# Altium schematic sheet 26_AKS.SchDoc
size 254 x 190 mm; SheetNumber: 1; SheetTotal: 1
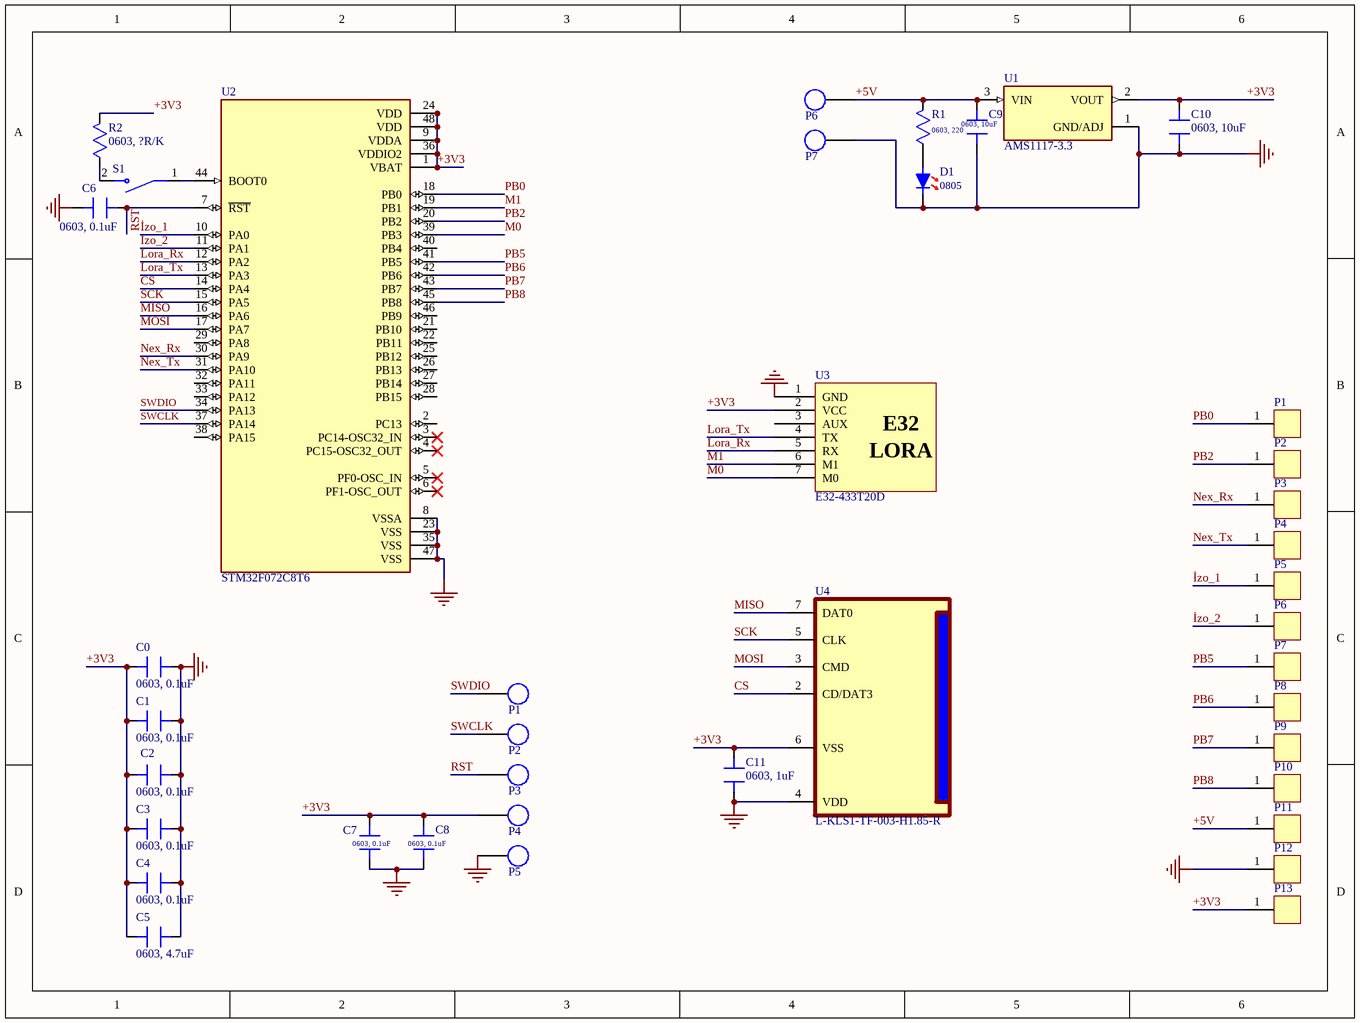
[diagram p0: 26_AKS.SchDoc]

## Parts
(Parts that share a designator on the sheet are numbered #1, #2 ... from top to bottom, then left to right.)
C0  0603, 0.1uF  [CAP 0603_1608]
C1  0603, 0.1uF  [CAP 0603_1608]
C2  0603, 0.1uF  [CAP 0603_1608]
C3  0603, 0.1uF  [CAP 0603_1608]
C4  0603, 0.1uF  [CAP 0603_1608]
C5  0603, 4.7uF  [CAP 0603_1608]
C6  0603, 0.1uF  [CAP 0603_1608]
C7  0603, 0.1uF  [CAP 0603_1608]
C8  0603, 0.1uF  [CAP 0603_1608]
C9  0603, 10uF  [CAP 0603_1608]
C10  0603, 10uF  [CAP 0603_1608]
C11  0603, 1uF  [CAP 0603_1608]
D1  0805  [LED 0805_2012 RED]
P1#1  Pad  [Pad]  (value not drawn)
P1#2  Pad  [PAD]  (value not drawn)
P2#1  Pad  [Pad]  (value not drawn)
P2#2  Pad  [PAD]  (value not drawn)
P3#1  Pad  [Pad]  (value not drawn)
P3#2  Pad  [PAD]  (value not drawn)
P4#1  Pad  [Pad]  (value not drawn)
P4#2  Pad  [PAD]  (value not drawn)
P5#1  Pad  [Pad]  (value not drawn)
P5#2  Pad  [PAD]  (value not drawn)
P6#1  Pad  [PAD]  (value not drawn)
P6#2  Pad  [Pad]  (value not drawn)
P7#1  Pad  [PAD]  (value not drawn)
P7#2  Pad  [Pad]  (value not drawn)
P8  Pad  [Pad]  (value not drawn)
P9  Pad  [Pad]  (value not drawn)
P10  Pad  [Pad]  (value not drawn)
P11  Pad  [Pad]  (value not drawn)
P12  Pad  [Pad]  (value not drawn)
P13  Pad  [Pad]  (value not drawn)
R1  0603, 220  [RES 0603_1608]
R2  0603, ?R/K  [RES 0603_1608]
S1  KAE01SGGT  [SW_KAE01SGGT]  (value not drawn)
U1  AMS1117-3.3  [SOT229P700X180-4N]
U2  STM32F072C8T6  [QFP50P900X900X160-48N]
U3  E32-433T20D  [LORA-E32]
U4  L-KLS1-TF-003-H1.85-R  [L-KLS1-TF-003-H1.85-R]

## Nets
GND: C0.1 C1.1 C2.1 C3.1 C4.2 C5.2 C6.2 C7.2 C8.2 C9.1 C10.1 C11.2 D1.2 P5#2.1 P7#1.1 P12.1 U1.1(GND/ADJ) U2.8(VSSA) U2.23(VSS) U2.35(VSS) U2.47(VSS) U3.1(GND) U4.4(VDD)
+3V3: C0.2 C1.2 C2.2 C3.2 C4.1 C5.1 C7.1 C8.1 C10.2 C11.1 P4#2.1 P13.1 R2.2 U1.2(VOUT) U2.1(VBAT) U2.9(VDDA) U2.24(VDD) U2.36(VDDIO2) U2.48(VDD) U3.2(VCC) U4.6(VSS)
+5V: C9.2 P6#1.1 P11.1 R1.2 U1.3(VIN)
CS: U2.14(PA4) U4.2(CD/DAT3)
İzo_1: P5#1.1 U2.10(PA0)
İzo_2: P6#2.1 U2.11(PA1)
Lora_Rx: U2.12(PA2) U3.5(RX)
Lora_Tx: U2.13(PA3) U3.4(TX)
M0: U2.39(PB3) U3.7(M0)
M1: U2.19(PB1) U3.6(M1)
MISO: U2.16(PA6) U4.7(DAT0)
MOSI: U2.17(PA7) U4.3(CMD)
Nex_Rx: P3#1.1 U2.30(PA9)
Nex_Tx: P4#1.1 U2.31(PA10)
PB0: P1#1.1 U2.18(PB0)
PB2: P2#1.1 U2.20(PB2)
PB5: P7#2.1 U2.41(PB5)
PB6: P8.1 U2.42(PB6)
PB7: P9.1 U2.43(PB7)
PB8: P10.1 U2.45(PB8)
RST: C6.1 P3#2.1 U2.7(~{RST})
SCK: U2.15(PA5) U4.5(CLK)
SWCLK: P2#2.1 U2.37(PA14)
SWDIO: P1#2.1 U2.34(PA13)
NetD1_1: D1.1 R1.1
NetR2_1: R2.1 S1.2
NetS1_1: S1.1 U2.44(BOOT0)

Not connected (* = marked no-connect by the designer): U2 2(PC13) 3(PC14-OSC32_IN)* 4(PC15-OSC32_OUT)* 5(PF0-OSC_IN)* 6(PF1-OSC_OUT)* 21(PB10) 22(PB11) 25(PB12) 26(PB13) 27(PB14) 28(PB15) 29(PA8) 32(PA11) 33(PA12) 38(PA15) 40(PB4) 46(PB9); U3 3(AUX)

## Notes on the sheet
- (in symbol LORA-E32) E32; LORA

## Library data of the parts
C0-C11 = 0603 Kapasitör
D1 = 0805 LED Red
R1 R2 = 0603 Direnç
S1 = KAE01SGGT: Dip Switch SPST 1 Position Surface Mount Slide (Standard) Actuator 25mA 24VDC; MF: E-Switch; Check_prices: https://www.snapeda.com/parts/KAE01SGGT/E-Switch/view-part/?ref=eda; Value: *; Availability: In Stock; MP: KAE01SGGT; Price: None; Package: None; SnapEDA_Link: https://www.snapeda.com/parts/KAE01SGGT/E-Switch/view-part/?ref=snap; Purchase-URL: https://pricing.snapeda.com/search/part/KAE01SGGT/?ref=eda
U1 = AMS1117-3.3: Sot223/Pkg 1-Amp 3.3-Volt Low Drop Out Voltage Regulatator; MF: Advanced Monolithic Systems; SnapEDA_Link: https://www.snapeda.com/parts/AMS1117-3.3/Advanced+Monolithic+Systems/view-part/?ref=snap; Package: SOT-223 Seeed Technology; Value: *; MP: AMS1117-3.3; Check_prices: https://www.snapeda.com/parts/AMS1117-3.3/Advanced+Monolithic+Systems/view-part/?ref=eda
U2 = STM32F072C8T6: ARMÂ® CortexÂ®-M0 STM32F0 Microcontroller IC 32-Bit Single-Core 48MHz 64KB (64K x 8) FLASH 48-LQFP (7x7); MF: STMicroelectronics; SnapEDA_Link: https://www.snapeda.com/parts/STM32F072C8T6/STMicroelectronics/view-part/?ref=snap; Package: LQFP-48 STMicroelectronics; Value: *; MP: STM32F072C8T6; Check_prices: https://www.snapeda.com/parts/STM32F072C8T6/STMicroelectronics/view-part/?ref=eda
U3 = LORA-E32: Design By @Alixahedi